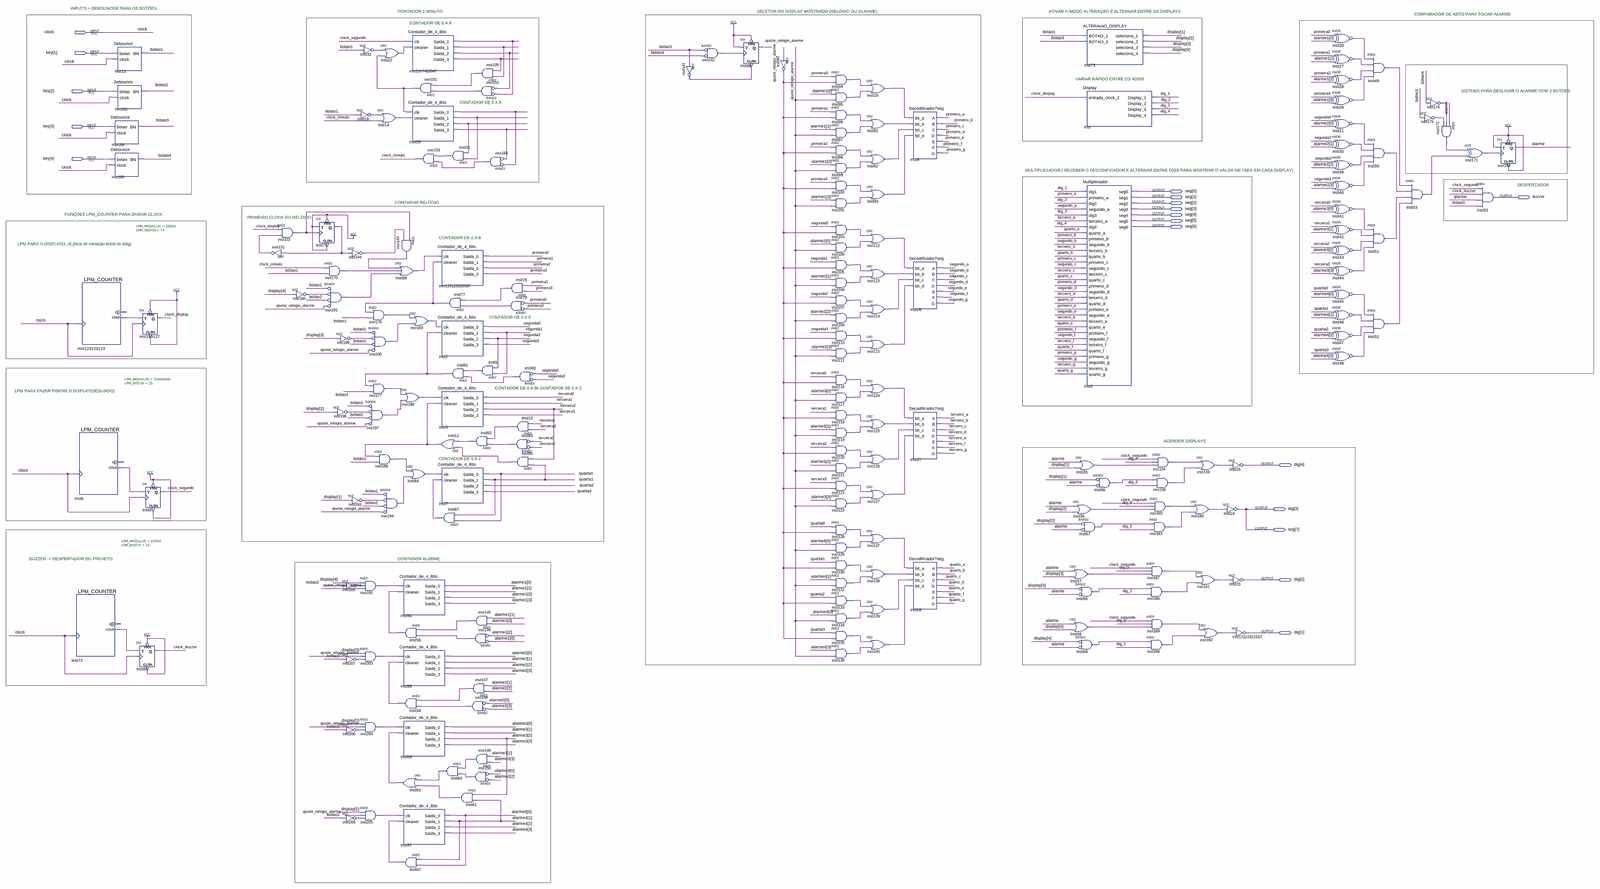
[diagram p0: schematic sheet, whole]
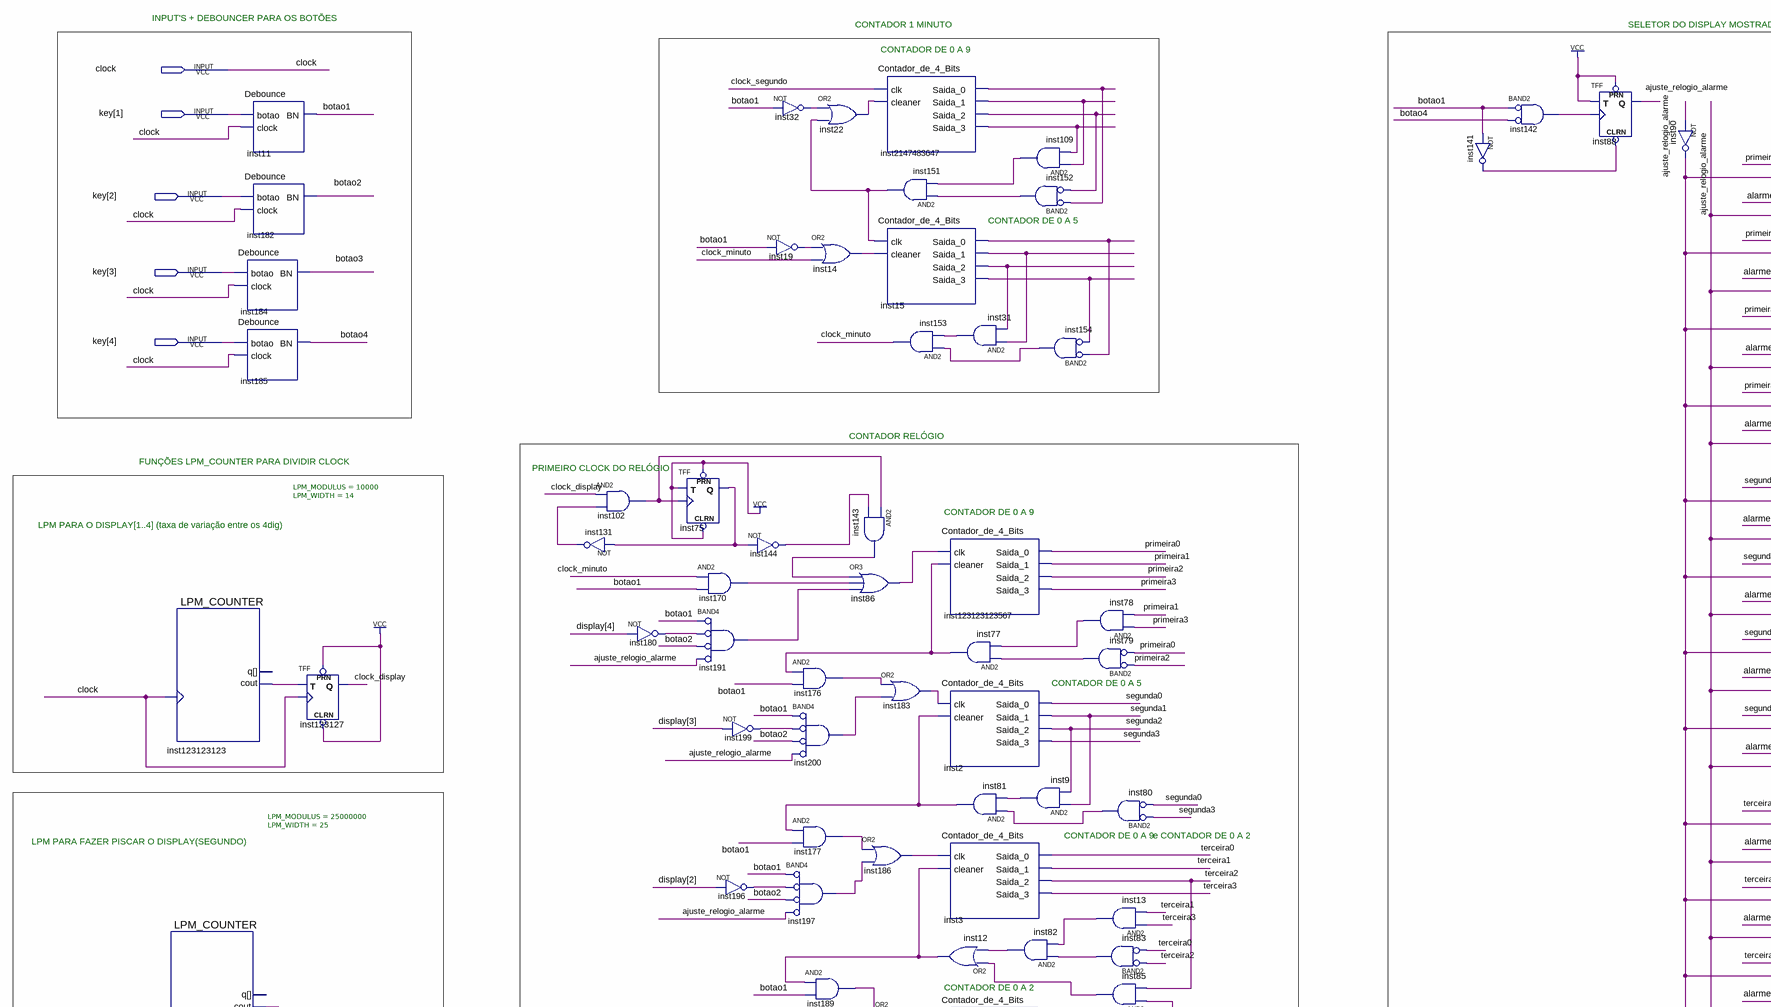
[diagram p1: schematic sheet, upper left part]
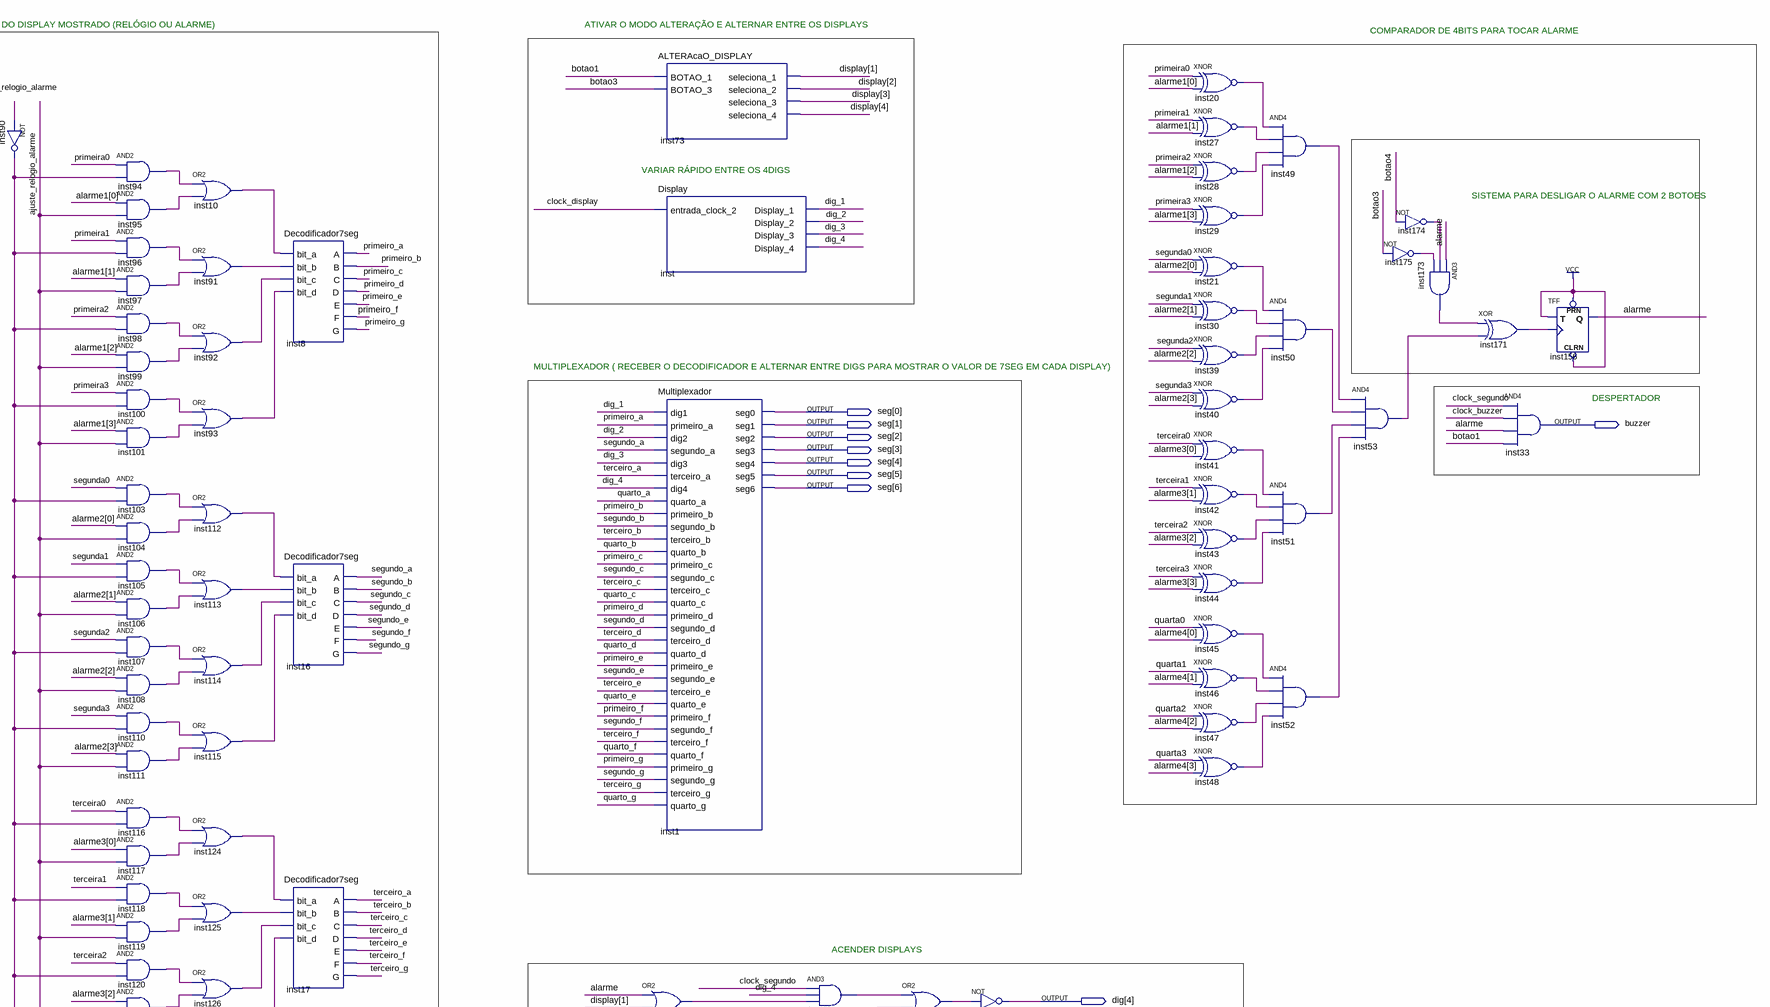
[diagram p2: schematic sheet, upper right part]
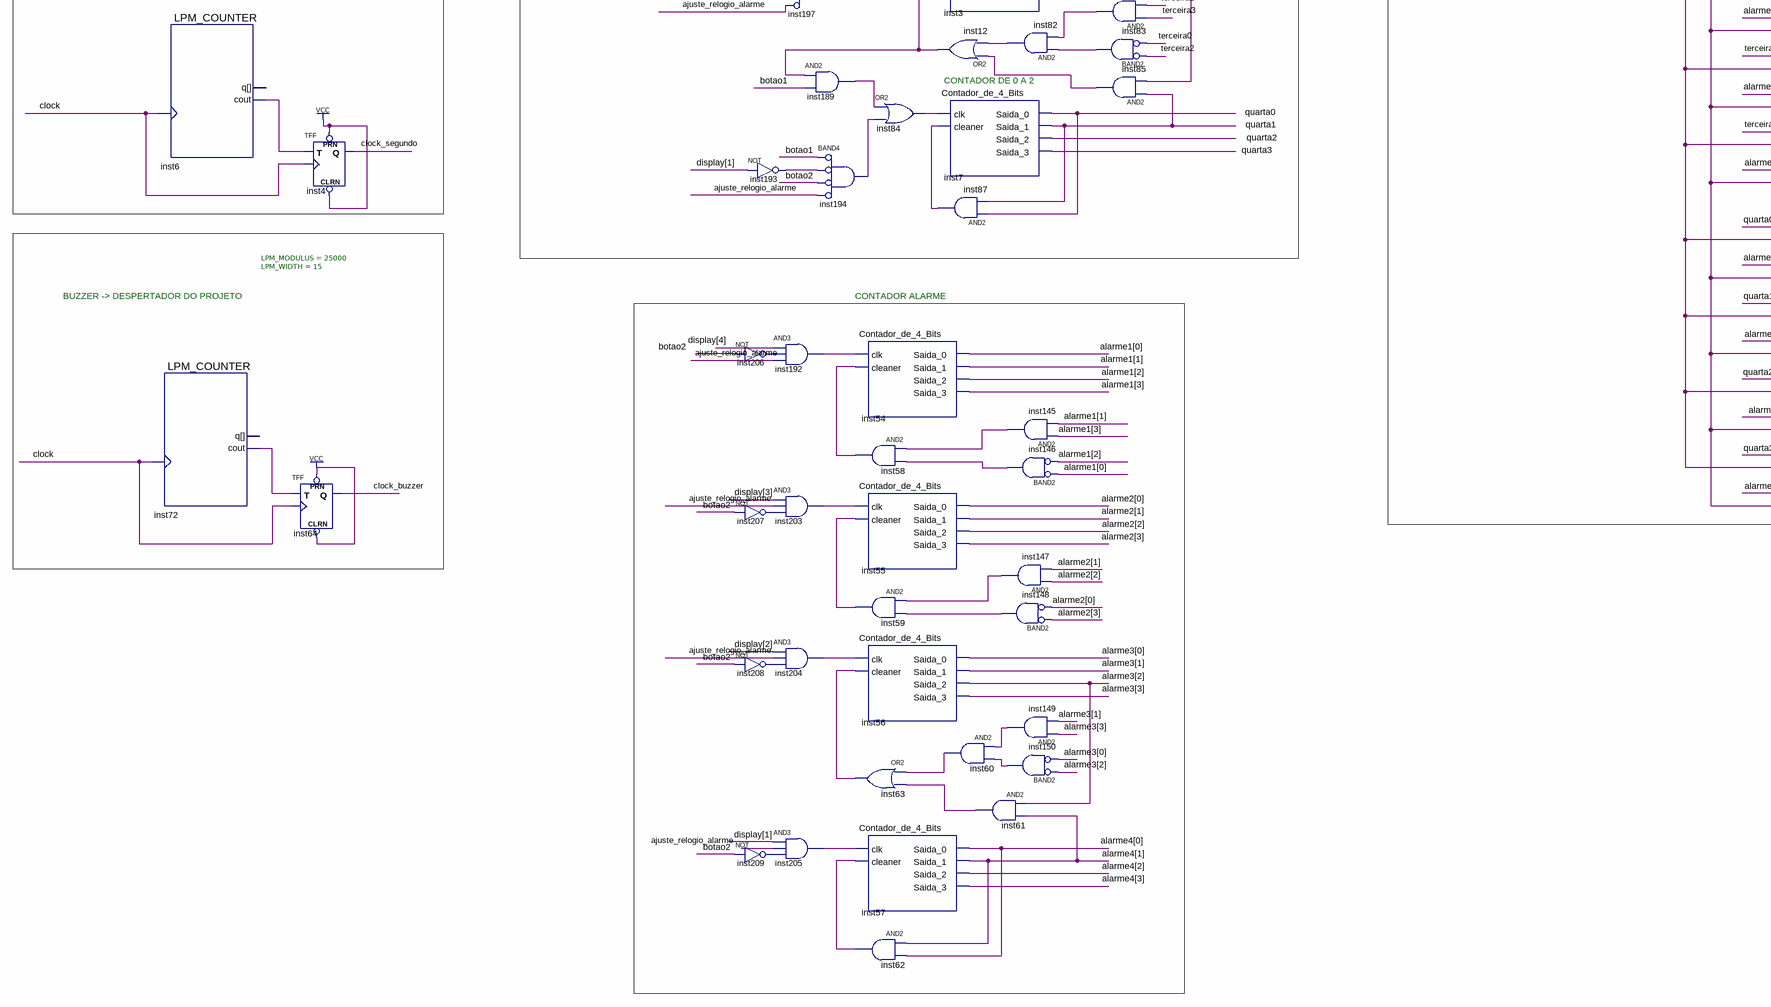
[diagram p3: schematic sheet, lower left part]
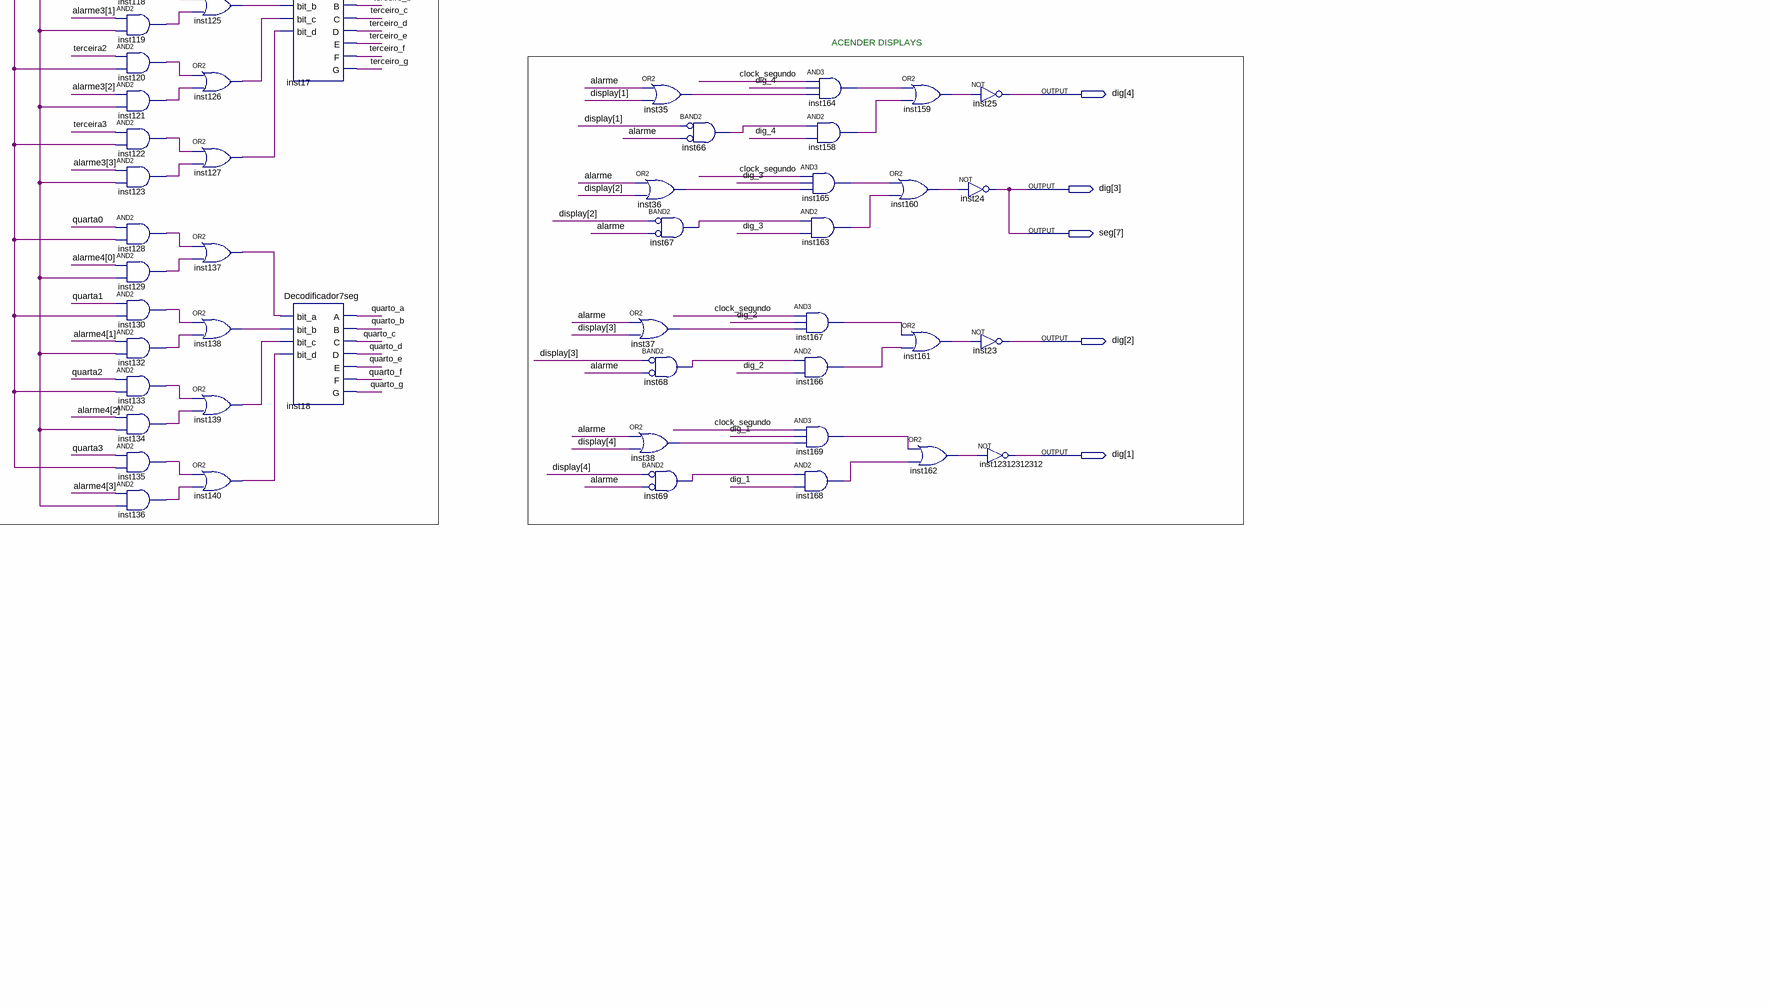
[diagram p4: schematic sheet, lower right part]
// Quartus schematic PROJETO_PRINCIPAL.bdf as structural Verilog: 193 symbols, 18 pins
module PROJETO_PRINCIPAL (
  input  clock,
  input  [4:1] key,
  output [7:0] seg,
  output buzzer,
  output [4:1] dig
);

  wire ajuste_relogio_alarme, alarme, botao1, botao2, botao3, botao4, clock_buzzer, clock_display,
       clock_minuto, clock_segundo, dig_1, dig_2, dig_3, dig_4, inst6_cout, inst9_out, inst10_out,
       inst12_out, inst13_out, inst14_out, inst15_saida_0, inst15_saida_1, inst15_saida_2, inst15_saida_3,
       inst19_out, inst20_out, inst21_out, inst22_out, inst27_out, inst28_out, inst29_out, inst30_out,
       inst31_out, inst32_out, inst35_out, inst36_out, inst37_out, inst38_out, inst39_out, inst40_out,
       inst41_out, inst42_out, inst43_out, inst44_out, inst45_out, inst46_out, inst47_out, inst48_out,
       inst49_out, inst50_out, inst51_out, inst52_out, inst53_out, inst58_out, inst59_out, inst60_out,
       inst61_out, inst62_out, inst63_out, inst66_out, inst67_out, inst68_out, inst69_out, inst72_cout,
       inst75_q, inst77_out, inst78_out, inst79_out, inst80_out, inst81_out, inst82_out, inst83_out,
       inst84_out, inst85_out, inst86_out, inst87_out, inst90_out, inst91_out, inst92_out, inst93_out,
       inst94_out, inst95_out, inst96_out, inst97_out, inst98_out, inst99_out, inst100_out, inst101_out,
       inst102_out, inst103_out, inst104_out, inst105_out, inst106_out, inst107_out, inst108_out,
       inst109_out, inst110_out, inst111_out, inst112_out, inst113_out, inst114_out, inst115_out,
       inst116_out, inst117_out, inst118_out, inst119_out, inst120_out, inst121_out, inst122_out,
       inst123_out, inst124_out, inst125_out, inst126_out, inst127_out, inst128_out, inst129_out,
       inst130_out, inst131_out, inst132_out, inst133_out, inst134_out, inst135_out, inst136_out,
       inst137_out, inst138_out, inst139_out, inst140_out, inst141_out, inst142_out, inst143_out,
       inst144_out, inst145_out, inst146_out, inst147_out, inst148_out, inst149_out, inst150_out,
       inst151_out, inst152_out, inst154_out, inst158_out, inst159_out, inst160_out, inst161_out,
       inst162_out, inst163_out, inst164_out, inst165_out, inst166_out, inst167_out, inst168_out,
       inst169_out, inst170_out, inst171_out, inst173_out, inst174_out, inst175_out, inst176_out,
       inst177_out, inst180_out, inst183_out, inst186_out, inst189_out, inst191_out, inst192_out,
       inst193_out, inst194_out, inst196_out, inst197_out, inst199_out, inst200_out, inst203_out,
       inst204_out, inst205_out, inst206_out, inst207_out, inst208_out, inst209_out, inst123123123_cout,
       inst2147483647_saida_0, inst2147483647_saida_1, inst2147483647_saida_2, inst2147483647_saida_3,
       primeira0, primeira1, primeira2, primeira3, primeiro_a, primeiro_b, primeiro_c, primeiro_d,
       primeiro_e, primeiro_f, primeiro_g, quarta0, quarta1, quarta2, quarta3, quarto_a, quarto_b, quarto_c,
       quarto_d, quarto_e, quarto_f, quarto_g, segunda0, segunda1, segunda2, segunda3, segundo_a, segundo_b,
       segundo_c, segundo_d, segundo_e, segundo_f, segundo_g, terceira0, terceira1, terceira2, terceira3,
       terceiro_a, terceiro_b, terceiro_c, terceiro_d, terceiro_e, terceiro_f, terceiro_g;
  wire [3:0] alarme1, alarme2, alarme3, alarme4;
  wire [4:1] display;

  LPM_COUNTER #(.LPM_MODULUS(10000), .LPM_WIDTH(14)) inst123123123 (
    .clock(clock), .cout(inst123123123_cout));  // open: q
  LPM_COUNTER #(.LPM_MODULUS(25000000), .LPM_WIDTH(25)) inst6 (.clock(clock), .cout(inst6_cout));  // open: q
  LPM_COUNTER #(.LPM_MODULUS(25000), .LPM_WIDTH(15)) inst72 (.clock(clock), .cout(inst72_cout));  // open: q
  Debounce inst184 (.botao(key[3]), .clock(clock), .BN(botao3));
  Debounce inst185 (.botao(key[4]), .clock(clock), .BN(botao4));
  Debounce inst11 (.botao(key[1]), .clock(clock), .BN(botao1));
  Debounce inst182 (.botao(key[2]), .clock(clock), .BN(botao2));
  TFF inst123127 (.PRN(1'b1), .CLRN(1'b1), .T(inst123123123_cout), .CLK(clock), .Q(clock_display));
  TFF inst4 (.PRN(1'b1), .CLRN(1'b1), .T(inst6_cout), .CLK(clock), .Q(clock_segundo));
  TFF inst64 (.PRN(1'b1), .CLRN(1'b1), .T(inst72_cout), .CLK(clock), .Q(clock_buzzer));
  not inst131 (inst131_out, inst75_q);
  and inst102 (inst102_out, clock_display, inst131_out);
  not inst180 (inst180_out, display[4]);
  TFF inst75 (.PRN(1'b1), .CLRN(1'b1), .T(1'b1), .CLK(inst102_out), .Q(inst75_q));
  and inst170 (inst170_out, clock_minuto, botao1);
  and inst191 (inst191_out, ~botao1, ~inst180_out, ~botao2, ~ajuste_relogio_alarme);  // BAND4
  not inst199 (inst199_out, display[3]);
  not inst196 (inst196_out, display[2]);
  not inst206 (inst206_out, botao2);
  not inst207 (inst207_out, botao2);
  not inst208 (inst208_out, botao2);
  not inst209 (inst209_out, botao2);
  not inst32 (inst32_out, botao1);
  not inst19 (inst19_out, botao1);
  not inst144 (inst144_out, inst75_q);
  and inst176 (inst176_out, inst77_out, botao1);
  and inst200 (inst200_out, ~botao1, ~inst199_out, ~botao2, ~ajuste_relogio_alarme);  // BAND4
  and inst177 (inst177_out, inst81_out, botao1);
  and inst197 (inst197_out, ~botao1, ~inst196_out, ~botao2, ~ajuste_relogio_alarme);  // BAND4
  not inst193 (inst193_out, display[1]);
  and inst192 (inst192_out, display[4], inst206_out, ajuste_relogio_alarme);
  and inst203 (inst203_out, display[3], ajuste_relogio_alarme, inst207_out);
  and inst204 (inst204_out, display[2], ajuste_relogio_alarme, inst208_out);
  and inst205 (inst205_out, display[1], ajuste_relogio_alarme, inst209_out);
  or inst22 (inst22_out, inst32_out, inst151_out);
  or inst14 (inst14_out, inst19_out, clock_minuto);
  and inst189 (inst189_out, inst12_out, botao1);
  and inst194 (inst194_out, ~botao1, ~inst193_out, ~botao2, ~ajuste_relogio_alarme);  // BAND4
  Contador_de_4_Bits inst2147483647 (
    .clk(clock_segundo), .cleaner(inst22_out), .Saida_0(inst2147483647_saida_0),
    .Saida_1(inst2147483647_saida_1), .Saida_2(inst2147483647_saida_2), .Saida_3(inst2147483647_saida_3));
  and inst151 (inst151_out, inst152_out, inst109_out);
  Contador_de_4_Bits inst15 (
    .clk(inst151_out), .cleaner(inst14_out), .Saida_0(inst15_saida_0), .Saida_1(inst15_saida_1),
    .Saida_2(inst15_saida_2), .Saida_3(inst15_saida_3));
  and inst153 (clock_minuto, inst154_out, inst31_out);
  and inst143 (inst143_out, inst102_out, inst144_out);
  or inst86 (inst86_out, inst143_out, inst170_out, inst191_out);
  or inst183 (inst183_out, inst176_out, inst200_out);
  or inst186 (inst186_out, inst177_out, inst197_out);
  or inst84 (inst84_out, inst189_out, inst194_out);
  Contador_de_4_Bits inst54 (
    .clk(inst192_out), .cleaner(inst58_out), .Saida_0(alarme1[0]), .Saida_1(alarme1[1]),
    .Saida_2(alarme1[2]), .Saida_3(alarme1[3]));
  and inst58 (inst58_out, inst145_out, inst146_out);
  Contador_de_4_Bits inst55 (
    .clk(inst203_out), .cleaner(inst59_out), .Saida_0(alarme2[0]), .Saida_1(alarme2[1]),
    .Saida_2(alarme2[2]), .Saida_3(alarme2[3]));
  and inst59 (inst59_out, inst147_out, inst148_out);
  Contador_de_4_Bits inst56 (
    .clk(inst204_out), .cleaner(inst63_out), .Saida_0(alarme3[0]), .Saida_1(alarme3[1]),
    .Saida_2(alarme3[2]), .Saida_3(alarme3[3]));
  or inst63 (inst63_out, inst60_out, inst61_out);
  Contador_de_4_Bits inst57 (
    .clk(inst205_out), .cleaner(inst62_out), .Saida_0(alarme4[0]), .Saida_1(alarme4[1]),
    .Saida_2(alarme4[2]), .Saida_3(alarme4[3]));
  and inst62 (inst62_out, alarme4[1], alarme4[0]);
  Contador_de_4_Bits inst123123123567 (
    .clk(inst86_out), .cleaner(inst77_out), .Saida_0(primeira0), .Saida_1(primeira1), .Saida_2(primeira2),
    .Saida_3(primeira3));
  Contador_de_4_Bits inst2 (
    .clk(inst183_out), .cleaner(inst81_out), .Saida_0(segunda0), .Saida_1(segunda1), .Saida_2(segunda2),
    .Saida_3(segunda3));
  Contador_de_4_Bits inst3 (
    .clk(inst186_out), .cleaner(inst12_out), .Saida_0(terceira0), .Saida_1(terceira1), .Saida_2(terceira2),
    .Saida_3(terceira3));
  or inst12 (inst12_out, inst85_out, inst82_out);
  Contador_de_4_Bits inst7 (
    .clk(inst84_out), .cleaner(inst87_out), .Saida_0(quarta0), .Saida_1(quarta1), .Saida_2(quarta2),
    .Saida_3(quarta3));
  and inst87 (inst87_out, quarta0, quarta1);
  and inst60 (inst60_out, inst149_out, inst150_out);
  and inst31 (inst31_out, inst15_saida_1, inst15_saida_2);
  and inst77 (inst77_out, inst79_out, inst78_out);
  and inst81 (inst81_out, inst80_out, inst9_out);
  and inst61 (inst61_out, alarme3[2], alarme4[1]);
  and inst109 (inst109_out, inst2147483647_saida_1, inst2147483647_saida_3);
  and inst152 (inst152_out, ~inst2147483647_saida_0, ~inst2147483647_saida_2);  // BAND2
  and inst154 (inst154_out, ~inst15_saida_0, ~inst15_saida_3);  // BAND2
  and inst9 (inst9_out, segunda1, segunda2);
  and inst82 (inst82_out, inst83_out, inst13_out);
  and inst145 (inst145_out, alarme1[3], alarme1[1]);
  and inst146 (inst146_out, ~alarme1[0], ~alarme1[2]);  // BAND2
  and inst147 (inst147_out, alarme2[2], alarme2[1]);
  and inst148 (inst148_out, ~alarme2[3], ~alarme2[0]);  // BAND2
  and inst149 (inst149_out, alarme3[3], alarme3[1]);
  and inst150 (inst150_out, ~alarme3[2], ~alarme3[0]);  // BAND2
  and inst78 (inst78_out, primeira3, primeira1);
  and inst79 (inst79_out, ~primeira2, ~primeira0);  // BAND2
  and inst13 (inst13_out, terceira3, terceira1);
  and inst83 (inst83_out, ~terceira2, ~terceira0);  // BAND2
  and inst85 (inst85_out, quarta1, terceira2);
  and inst80 (inst80_out, ~segunda3, ~segunda0);  // BAND2
  not inst141 (inst141_out, botao1);
  and inst142 (inst142_out, ~botao1, ~botao4);  // BAND2
  TFF inst88 (.PRN(1'b1), .CLRN(inst141_out), .T(1'b1), .CLK(inst142_out), .Q(ajuste_relogio_alarme));
  not inst90 (inst90_out, ajuste_relogio_alarme);
  and inst94 (inst94_out, primeira0, inst90_out);
  and inst95 (inst95_out, alarme1[0], ajuste_relogio_alarme);
  and inst96 (inst96_out, primeira1, inst90_out);
  and inst97 (inst97_out, alarme1[1], ajuste_relogio_alarme);
  and inst98 (inst98_out, primeira2, inst90_out);
  and inst99 (inst99_out, alarme1[2], ajuste_relogio_alarme);
  and inst100 (inst100_out, primeira3, inst90_out);
  and inst101 (inst101_out, alarme1[3], ajuste_relogio_alarme);
  and inst103 (inst103_out, segunda0, inst90_out);
  and inst104 (inst104_out, alarme2[0], ajuste_relogio_alarme);
  and inst105 (inst105_out, segunda1, inst90_out);
  and inst106 (inst106_out, alarme2[1], ajuste_relogio_alarme);
  and inst107 (inst107_out, segunda2, inst90_out);
  and inst108 (inst108_out, alarme2[2], ajuste_relogio_alarme);
  and inst110 (inst110_out, segunda3, inst90_out);
  and inst111 (inst111_out, alarme2[3], ajuste_relogio_alarme);
  and inst116 (inst116_out, terceira0, inst90_out);
  and inst117 (inst117_out, alarme3[0], ajuste_relogio_alarme);
  and inst118 (inst118_out, terceira1, inst90_out);
  and inst119 (inst119_out, alarme3[1], ajuste_relogio_alarme);
  and inst120 (inst120_out, terceira2, inst90_out);
  and inst121 (inst121_out, alarme3[2], ajuste_relogio_alarme);
  and inst122 (inst122_out, terceira3, inst90_out);
  and inst123 (inst123_out, alarme3[3], ajuste_relogio_alarme);
  and inst128 (inst128_out, quarta0, inst90_out);
  and inst129 (inst129_out, alarme4[0], ajuste_relogio_alarme);
  and inst130 (inst130_out, quarta1, inst90_out);
  and inst132 (inst132_out, alarme4[1], ajuste_relogio_alarme);
  and inst133 (inst133_out, quarta2, inst90_out);
  and inst134 (inst134_out, alarme4[2], ajuste_relogio_alarme);
  and inst135 (inst135_out, quarta3, inst90_out);
  and inst136 (inst136_out, alarme4[3], ajuste_relogio_alarme);
  or inst10 (inst10_out, inst94_out, inst95_out);
  or inst91 (inst91_out, inst96_out, inst97_out);
  or inst92 (inst92_out, inst98_out, inst99_out);
  or inst93 (inst93_out, inst100_out, inst101_out);
  or inst112 (inst112_out, inst103_out, inst104_out);
  or inst113 (inst113_out, inst105_out, inst106_out);
  or inst114 (inst114_out, inst107_out, inst108_out);
  or inst115 (inst115_out, inst110_out, inst111_out);
  or inst124 (inst124_out, inst116_out, inst117_out);
  or inst125 (inst125_out, inst118_out, inst119_out);
  or inst126 (inst126_out, inst120_out, inst121_out);
  or inst127 (inst127_out, inst122_out, inst123_out);
  or inst137 (inst137_out, inst128_out, inst129_out);
  or inst138 (inst138_out, inst130_out, inst132_out);
  or inst139 (inst139_out, inst133_out, inst134_out);
  or inst140 (inst140_out, inst135_out, inst136_out);
  Decodificador7seg inst8 (
    .bit_a(inst10_out), .bit_b(inst91_out), .bit_c(inst92_out), .bit_d(inst93_out), .A(primeiro_a),
    .B(primeiro_b), .C(primeiro_c), .D(primeiro_d), .E(primeiro_e), .F(primeiro_f), .G(primeiro_g));
  Decodificador7seg inst16 (
    .bit_a(inst112_out), .bit_b(inst113_out), .bit_c(inst114_out), .bit_d(inst115_out), .A(segundo_a),
    .B(segundo_b), .C(segundo_c), .D(segundo_d), .E(segundo_e), .F(segundo_f), .G(segundo_g));
  Decodificador7seg inst17 (
    .bit_a(inst124_out), .bit_b(inst125_out), .bit_c(inst126_out), .bit_d(inst127_out), .A(terceiro_a),
    .B(terceiro_b), .C(terceiro_c), .D(terceiro_d), .E(terceiro_e), .F(terceiro_f), .G(terceiro_g));
  Decodificador7seg inst18 (
    .bit_a(inst137_out), .bit_b(inst138_out), .bit_c(inst139_out), .bit_d(inst140_out), .A(quarto_a),
    .B(quarto_b), .C(quarto_c), .D(quarto_d), .E(quarto_e), .F(quarto_f), .G(quarto_g));
  or inst35 (inst35_out, alarme, display[1]);
  or inst36 (inst36_out, alarme, display[2]);
  or inst37 (inst37_out, alarme, display[3]);
  and inst68 (inst68_out, ~display[3], ~alarme);  // BAND2
  or inst38 (inst38_out, alarme, display[4]);
  and inst69 (inst69_out, ~display[4], ~alarme);  // BAND2
  ALTERAcaO_DISPLAY inst73 (
    .BOTAO_1(botao1), .BOTAO_3(botao3), .seleciona_1(display[1]), .seleciona_2(display[2]),
    .seleciona_3(display[3]), .seleciona_4(display[4]));
  Display inst (
    .entrada_clock_2(clock_display), .Display_1(dig_1), .Display_2(dig_2), .Display_3(dig_3),
    .Display_4(dig_4));
  Multiplexador inst1 (
    .dig1(dig_1), .primeiro_a(primeiro_a), .dig2(dig_2), .segundo_a(segundo_a), .dig3(dig_3),
    .terceiro_a(terceiro_a), .dig4(dig_4), .quarto_a(quarto_a), .primeiro_b(primeiro_b),
    .segundo_b(segundo_b), .terceiro_b(terceiro_b), .quarto_b(quarto_b), .primeiro_c(primeiro_c),
    .segundo_c(segundo_c), .terceiro_c(terceiro_c), .quarto_c(quarto_c), .primeiro_d(primeiro_d),
    .segundo_d(segundo_d), .terceiro_d(terceiro_d), .quarto_d(quarto_d), .primeiro_e(primeiro_e),
    .segundo_e(segundo_e), .terceiro_e(terceiro_e), .quarto_e(quarto_e), .primeiro_f(primeiro_f),
    .segundo_f(segundo_f), .terceiro_f(terceiro_f), .quarto_f(quarto_f), .primeiro_g(primeiro_g),
    .segundo_g(segundo_g), .terceiro_g(terceiro_g), .quarto_g(quarto_g), .seg0(seg[0]), .seg1(seg[1]),
    .seg2(seg[2]), .seg3(seg[3]), .seg4(seg[4]), .seg5(seg[5]), .seg6(seg[6]));
  and inst66 (inst66_out, ~display[1], ~alarme);  // BAND2
  and inst67 (inst67_out, ~display[2], ~alarme);  // BAND2
  and inst167 (inst167_out, clock_segundo, dig_2, inst37_out);
  and inst166 (inst166_out, inst68_out, dig_2);
  and inst169 (inst169_out, clock_segundo, dig_1, inst38_out);
  and inst168 (inst168_out, inst69_out, dig_1);
  and inst164 (inst164_out, clock_segundo, dig_4, inst35_out);
  and inst158 (inst158_out, inst66_out, dig_4);
  and inst165 (inst165_out, clock_segundo, dig_3, inst36_out);
  and inst163 (inst163_out, inst67_out, dig_3);
  or inst160 (inst160_out, inst165_out, inst163_out);
  or inst159 (inst159_out, inst164_out, inst158_out);
  or inst161 (inst161_out, inst167_out, inst166_out);
  or inst162 (inst162_out, inst169_out, inst168_out);
  not inst25 (dig[4], inst159_out);
  not inst24 (dig[3], inst160_out);
  not inst23 (dig[2], inst161_out);
  not inst12312312312 (dig[1], inst162_out);
  xnor inst20 (inst20_out, primeira0, alarme1[0]);
  xnor inst27 (inst27_out, primeira1, alarme1[1]);
  xnor inst28 (inst28_out, primeira2, alarme1[2]);
  xnor inst29 (inst29_out, primeira3, alarme1[3]);
  xnor inst21 (inst21_out, segunda0, alarme2[0]);
  xnor inst30 (inst30_out, segunda1, alarme2[1]);
  xnor inst39 (inst39_out, segunda2, alarme2[2]);
  xnor inst40 (inst40_out, segunda3, alarme2[3]);
  xnor inst41 (inst41_out, terceira0, alarme3[0]);
  xnor inst42 (inst42_out, terceira1, alarme3[1]);
  xnor inst43 (inst43_out, terceira2, alarme3[2]);
  xnor inst44 (inst44_out, terceira3, alarme3[3]);
  xnor inst45 (inst45_out, quarta0, alarme4[0]);
  xnor inst46 (inst46_out, quarta1, alarme4[1]);
  xnor inst47 (inst47_out, quarta2, alarme4[2]);
  xnor inst48 (inst48_out, quarta3, alarme4[3]);
  and inst49 (inst49_out, inst20_out, inst27_out, inst28_out, inst29_out);
  and inst50 (inst50_out, inst21_out, inst30_out, inst39_out, inst40_out);
  and inst51 (inst51_out, inst41_out, inst42_out, inst43_out, inst44_out);
  and inst52 (inst52_out, inst45_out, inst46_out, inst47_out, inst48_out);
  and inst53 (inst53_out, inst49_out, inst50_out, inst51_out, inst52_out);
  not inst174 (inst174_out, botao4);
  not inst175 (inst175_out, botao3);
  and inst173 (inst173_out, alarme, inst174_out, inst175_out);
  xor inst171 (inst171_out, inst173_out, inst53_out);
  and inst33 (buzzer, clock_segundo, clock_buzzer, alarme, botao1);
  TFF inst156 (.PRN(1'b1), .CLRN(1'b1), .T(1'b1), .CLK(inst171_out), .Q(alarme));

  assign seg[7] = dig[3];

  // Notes on the sheet:
  //   INPUT'S + DEBOUNCER PARA OS BOTÕES
  //   CONTADOR 1 MINUTO
  //   SELETOR DO DISPLAY MOSTRADO (RELÓGIO OU ALARME)
  //   ATIVAR O MODO ALTERAÇÃO E ALTERNAR ENTRE OS DISPLAYS 
  //   COMPARADOR DE 4BITS PARA TOCAR ALARME
  //   CONTADOR DE 0 A 9
  //   VARIAR RÁPIDO ENTRE OS 4DIGS 
  //   SISTEMA PARA DESLIGAR O ALARME COM 2 BOTOES
  //   CONTADOR DE 0 A 5
  //   MULTIPLEXADOR ( RECEBER O DECODIFICADOR E ALTERNAR ENTRE DIGS PARA MOSTRAR O VALOR DE 7SEG EM CADA DISPLAY)
  //   DESPERTADOR 
  //   CONTADOR RELÓGIO
  //   FUNÇÕES LPM_COUNTER PARA DIVIDIR CLOCK 
  //   PRIMEIRO CLOCK DO RELÓGIO 
  //   CONTADOR DE 0 A 9
  //   LPM PARA O DISPLAY[1..4] (taxa de variação entre os 4dig)
  //   CONTADOR DE 0 A 5
  //   CONTADOR DE 0 A 9 
  //   e CONTADOR DE 0 A 2
  //   LPM PARA FAZER PISCAR O DISPLAY(SEGUNDO)
  //   ACENDER DISPLAYS
  //   CONTADOR DE 0 A 2
  //   BUZZER -> DESPERTADOR DO PROJETO
  //   CONTADOR ALARME
endmodule
